# EAGLE design Final flipped Schematic model (EAGLE 9.5.1)
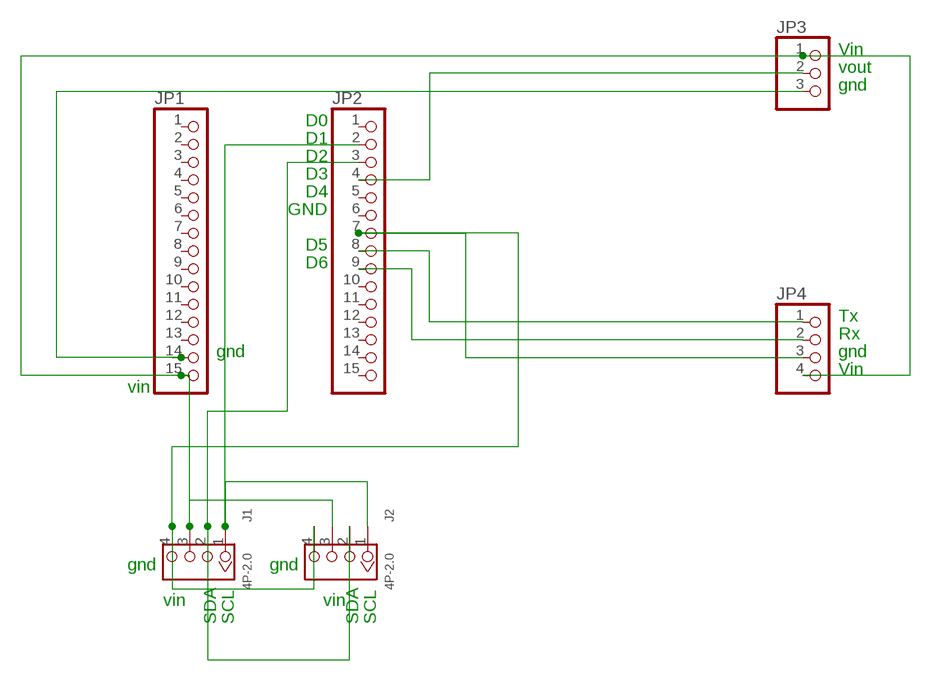
[diagram p0: schematic, sheet 1]

## Parts
J1  4P-2.0  GROVE-CONNECTOR-DIP(4P-2.0)  [HW4-2.0]
J2  4P-2.0  GROVE-CONNECTOR-DIP(4P-2.0)  [HW4-2.0]
JP1  PINHD-1X15  [1X15]
JP2  PINHD-1X15  [1X15]
JP3  PINHD-1X3  [1X03]
JP4  PINHD-1X4  [1X04]

## Nets
N$1: JP2.8 JP4.1
N$2: JP2.9 JP4.2
N$3: JP2.4 JP3.2
N$4: J1.1 J2.1 JP2.2
N$5: J1.4 J2.4 JP2.7 JP4.3
N$6: J1.2 J2.2 JP2.3
N$8: J1.3 J2.3 JP1.15 JP3.1 JP4.4
N$9: JP1.14 JP3.3
Unconnected: JP1.1 JP1.2 JP1.3 JP1.4 JP1.5 JP1.6 JP1.7 JP1.8 JP1.9 JP1.10 JP1.11 JP1.12 JP1.13 JP2.1 JP2.5 JP2.6 JP2.10 JP2.11 JP2.12 JP2.13 JP2.14 JP2.15

## Notes on the sheet
- Vin
- vout
- gnd
- D0
- D1
- D2
- D3
- D4
- GND
- D5
- D6
- Tx
- Rx
- gnd | gnd
- Vin
- vin
- gnd | gnd
- vin | vin
- SDA | SCL | SDA | SCL

## Library data of the parts
J1 J2 = OPL_Connector:GROVE-CONNECTOR-DIP(4P-2.0): 320110033
JP1 JP2 = pinhead:PINHD-1X15: PIN HEADER
JP3 = pinhead:PINHD-1X3: PIN HEADER
JP4 = pinhead:PINHD-1X4: PIN HEADER

## Board
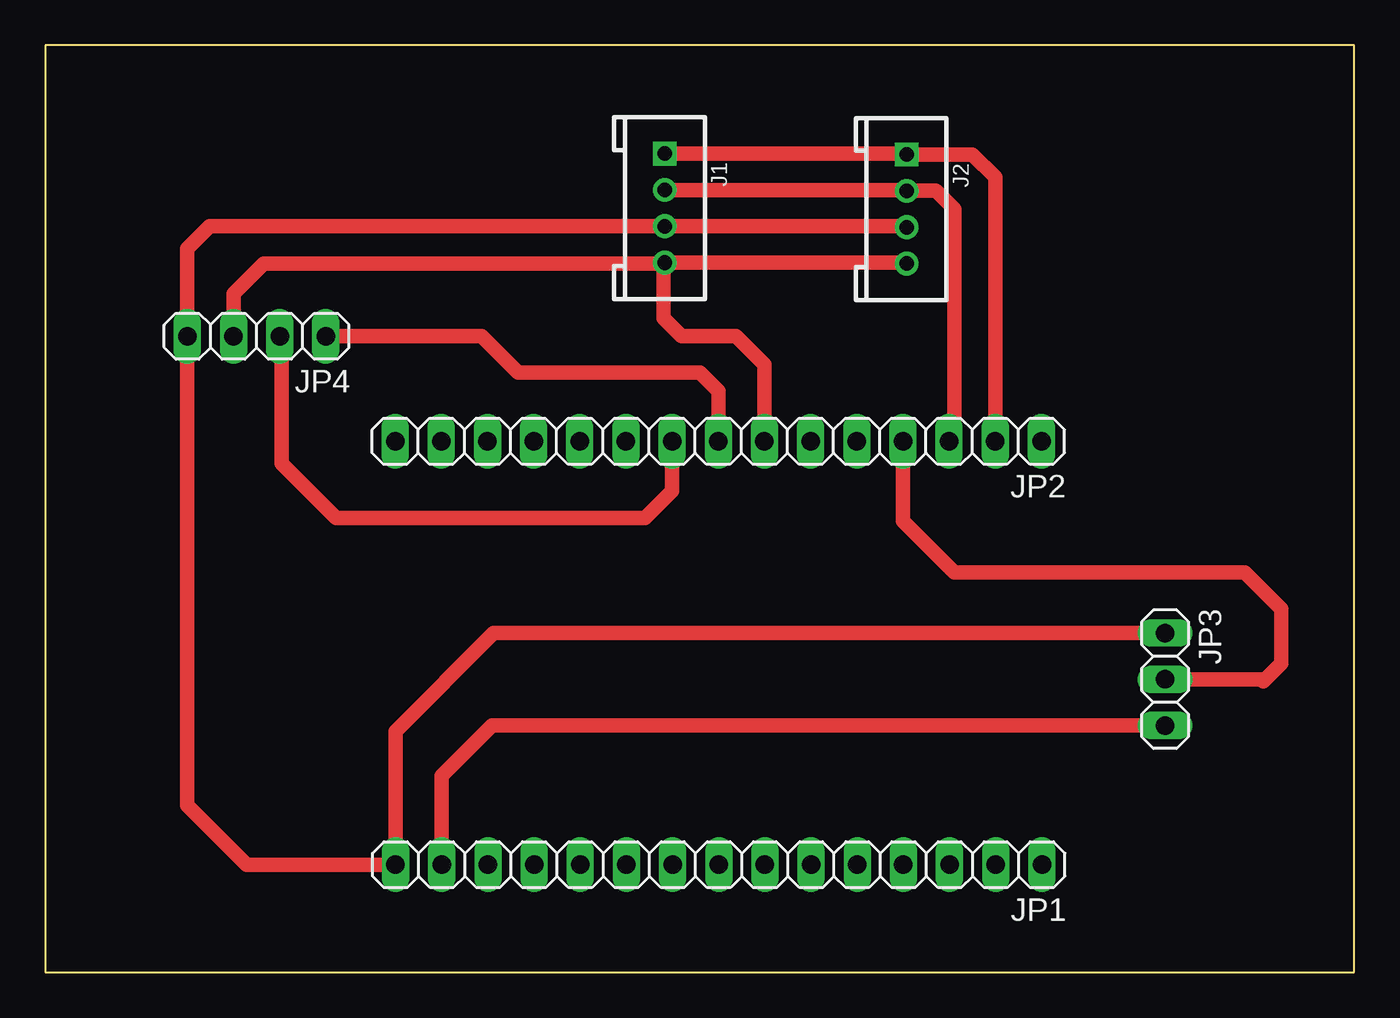
[diagram p1: board, top side]

Size 72 x 51 mm. Coordinates in mm from the lower left corner, seen from the top.
Outline: 0,51 0,0 72,0 72,51 0,51
Copper layers (1*16): Top 0.035mm / dielectric 1.5mm / Bottom 0.035mm
Design rules "default": minimum track width 6mil, minimum drill 0.35mm, track to track 6mil, track to pad 6mil, pad to pad 6mil, via to via 6mil, smd to smd 6mil, copper to edge 40mil, drill to drill 6mil, minimum pad ring 10mil, minimum via ring 8mil, stop-mask expansion 4mil, vias tented up to drill 0mil, thermal gap 10mil

### Footprints (pad centres in the part's own frame; a part is rotated, then mirrored left to right if it is on the bottom)
HW4-2.0 = drill 0.8 pad 1.27 square: 1 -3,0 | drill 0.8 pad 1.27: 2 -1,0; 3 1,0; 4 3,0
1X15 = drill 1.016 long: 1 -17.78,0; 2 -15.24,0; 3 -12.7,0; 4 -10.16,0; 5 -7.62,0; 6 -5.08,0; 7 -2.54,0; 8 0,0; 9 2.54,0; 10 5.08,0; 11 7.62,0; 12 10.16,0; 13 12.7,0; 14 15.24,0; 15 17.78,0
1X03 = drill 1.016 long: 1 -2.54,0; 2 0,0; 3 2.54,0
1X04 = drill 1.016 long: 1 -3.81,0; 2 -1.27,0; 3 1.27,0; 4 3.81,0

### Placement (x,y rotation side)
J1  34.08,42.05 270 top
J2  47.38,42 270 top
JP1  37.05,5.92 180 top
JP2  37.02,29.22 180 top
JP3  61.6,16.12 270 top
JP4  11.62,35 180 top

### Tracks (layer width: path | path; a pad name or v marks a point on that pad's centre or on a via)
N$1
  Top 0.8: JP2.8 37.02,31.98 36,33 26,33 24,35 JP4.1
N$2
  Top 0.8: JP2.9 34.48,26.48 33,25 16,25 13,28 13,34.89 JP4.2
N$3
  Top 0.8: JP2.4 47.18,24.82 50,22 66,22 68,20 68,17 67.5,16.5 67.12,16.12 | 67.12,16.12 67,16 | 67.12,16.12 JP3.2
N$4
  Top 0.8: J1.1 47.33,45.05 J2.1 51,45 52.26,43.74 JP2.2
N$5
  Top 0.8: J2.4 47.33,39.05 J1.4 34.02,38.98 | JP2.7 39.56,33.44 38,35 35,35 34,36 34,38.97 34.02,38.98 | JP4.3 10.35,37.35 12,39 34,39 34.02,38.98
N$6
  Top 0.8: J1.2 47.33,43.05 J2.2 49,43 50,42 50,29.5 JP2.3
N$8
  Top 0.8: J2.3 47.33,41.05 J1.3 9.05,41.05 7.81,39.81 JP4.4 7.81,9.19 11.08,5.92 JP1.15 19.27,13.27 24.66,18.66 JP3.1
N$9
  Top 0.8: 22,6.12 JP1.14 21.8,10.8 24.58,13.58 JP3.3